# EAGLE design Week_9_8 (EAGLE 9.5.2)
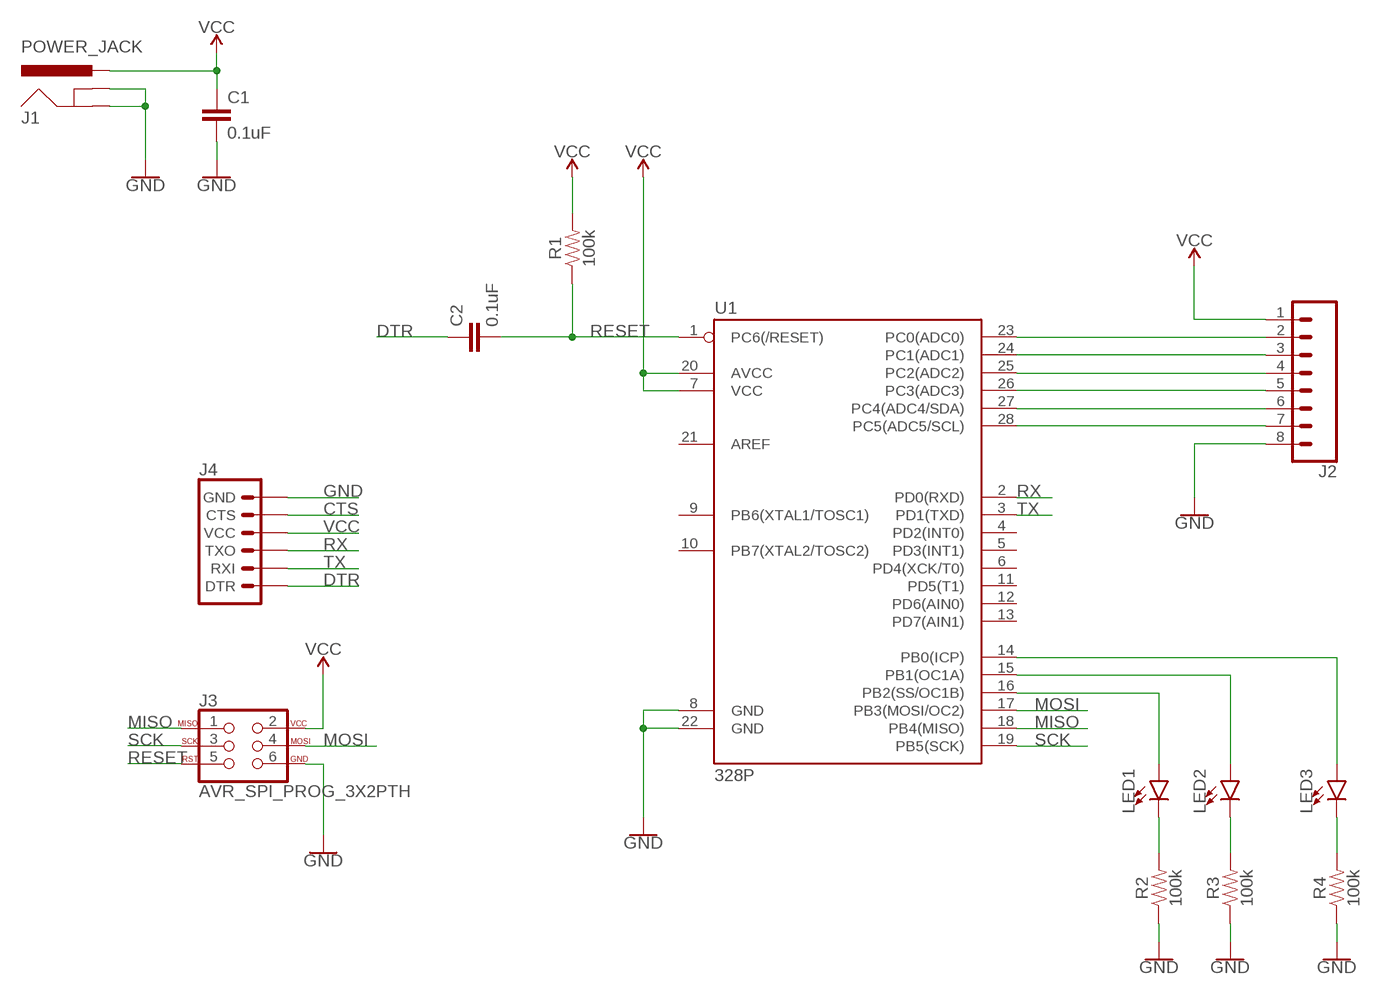
[diagram p0: schematic, sheet 1]

## Parts
C1  0.1uF  0.1UF-KIT-EZ-50V-20%  [CAP-PTH-SMALL-KIT]
C2  0.1uF  0.1UF-KIT-EZ-50V-20%  [CAP-PTH-SMALL-KIT]
J1  POWER_JACK  [POWER_JACK_PTH]
J2  CONN_08"  [1X08]
J3  AVR_SPI_PROG_3X2PTH  [2X3]
J4  6_PIN_SERIAL_TARGET  [1X06]
LED1  LED5MM  [LED_5MM]
LED2  LED5MM  [LED_5MM]
LED3  LED5MM  [LED_5MM]
R1  100k  100KOHM-HORIZ-1/4W-1%  [AXIAL-0.3]
R2  100k  100KOHM-HORIZ-1/4W-1%  [AXIAL-0.3]
R3  100k  100KOHM-HORIZ-1/4W-1%  [AXIAL-0.3]
R4  100k  100KOHM-HORIZ-1/4W-1%  [AXIAL-0.3]
U1  328P  ATMEGA328P_PDIP  [DIP28]

## Nets
CTS: J4.5(CTS)
DTR: C2.1 J4.1(DTR)
GND: C1.2 J1.GND J1.GNDBREAK J2.8 J3.6 J4.6(GND) R2.P$1 R3.P$1 R4.P$1 U1.8(GND) U1.22(GND)
MISO: J3.1 U1.18(PB4(MISO))
MOSI: J3.4 U1.17(PB3(MOSI/OC2))
N$2: LED3.K(C) R4.P$2
N$3: LED2.K(C) R3.P$2
N$4: LED1.K(C) R2.P$2
N$5: LED3.A U1.14(PB0(ICP))
N$6: LED2.A U1.15(PB1(OC1A))
N$7: LED1.A U1.16(PB2(SS/OC1B))
N$8: J2.2 U1.23(PC0(ADC0))
N$9: J2.3 U1.24(PC1(ADC1))
N$10: J2.4 U1.25(PC2(ADC2))
N$11: J2.5 U1.26(PC3(ADC3))
N$12: J2.6 U1.27(PC4(ADC4/SDA))
N$13: J2.7 U1.28(PC5(ADC5/SCL))
RESET: C2.2 J3.5 R1.P$1 U1.1(PC6(/RESET))
RX: J4.3(TXO) U1.2(PD0(RXD))
SCK: J3.3 U1.19(PB5(SCK))
TX: J4.2(RXI) U1.3(PD1(TXD))
VCC: C1.1 J1.PWR J2.1 J3.2 J4.4(VCC) R1.P$2 U1.7(VCC) U1.20(AVCC)
Unconnected: U1.4(PD2(INT0)) U1.5(PD3(INT1)) U1.6(PD4(XCK/T0)) U1.9(PB6(XTAL1/TOSC1)) U1.10(PB7(XTAL2/TOSC2)) U1.11(PD5(T1)) U1.12(PD6(AIN0)) U1.13(PD7(AIN1)) U1.21(AREF)

## Library data of the parts
C1 C2 = SparkFun-Capacitors:0.1UF: 0.1µF ceramic capacitors A capacitor is a passive two-terminal electrical component used to store electrical energy temporarily in an electric field.; PROD_ID: CAP-08370
J1 = SparkFun-Connectors:POWER_JACK: Power Jack Connector This is the standard 5.5mm barrel jack for power. The PTH is the most common, proven, reliable, footprint. The Slot footprint only works if the mill layer is transmitted to the PCB fab house so be warned. Here are the connectors we sell at SparkFun: DC Barrel Power Jack/Connector <https://www.sparkfun.com/products/119> (PRT-00119) DC Barrel Power Jack/Connector (SMD) <https://www.sparkfun.com/products/12748> (PRT-12748) DC Barrel Jack Adapter - Breadboard Compatible <https://www.sparkfun.com/products/10811> (PRT-10811) It is used on this SparkFun product (and many, many others): SparkFun RedBoard - Programmed with Arduino <https://www.sparkfun.com/products/12757> (DEV-12757) Also, if you need a mating power supply or connector, please check these out: Wall Adapter Power Supply - 9VDC 650mA <https://www.sparkfun.com/products/298> (TOL-00298) DC Barrel Jack Adapter - Male <https://www.sparkfun.com/products/10287> (PRT-10287); PROD_ID: CONN-08197
J2 = SparkFun-Connectors:CONN_08: Multi connection point. Often used as Generic Header-pin footprint for 0.1 inch spaced/style header connections On any of the 0.1 inch spaced packages, you can populate with these: Break Away Headers - Straight <https://www.sparkfun.com/products/116> (PRT-00116) Break Away Male Headers - Right Angle <https://www.sparkfun.com/products/553> (PRT-00553) Female Headers <https://www.sparkfun.com/products/115> (PRT-00115) Break Away Headers - Machine Pin <https://www.sparkfun.com/products/117> (PRT-00117) Break Away Female Headers - Swiss Machine Pin <https://www.sparkfun.com/products/743> (PRT-00743) Arduino Stackable Header - 8 Pin <https://www.sparkfun.com/products/9279> (PRT-09279) For SCREWTERMINALS and SPRING TERMINALS visit here: Screw Terimnals on SparkFun.com <https://www.sparkfun.com/search/results?term=Screw+Terminals> (5mm/3.5mm/2.54mm spacing) This device is also useful as a general connection point to wire up your design to another part of your project. Our various solder wires solder well into these plated through hole pads. Hook-Up Wire - Assortment (Stranded, 22 AWG) <https://www.sparkfun.com/products/11375> (PRT-11375) Hook-Up Wire - Assortment (Solid Core, 22 AWG) <https://www.sparkfun.com/products/11367> (PRT-11367) View the entire wire category on our website here <https://www.sparkfun.com/categories/141> Special notes: Molex polarized connector foot print use with SKU : PRT-08231 with associated crimp pins and housings. 1MM SMD Version SKU: PRT-10208 NOTES ON THE VARIANTS LOCK and LOCK_LONGPADS... This footprint was designed to help hold the alignment of a through-hole component (i.e. 6-pin header) while soldering it into place. You may notice that each hole has been shifted either up or down by 0.005 of an inch from it's more standard position (which is a perfectly straight line). This slight alteration caused the pins (the squares in the middle) to touch the edges of the holes. Because they are alternating, it causes a "brace" to hold the component in place. 0.005 has proven to be the perfect amount of "off-center" position when using our standard breakaway headers. Although looks a little odd when you look at the bare footprint, once you have a header in there, the alteration is very hard to notice. Also,if you push a header all the way into place, it is covered up entirely on the bottom side.; PROD_ID: CONN-08438
J3 = SparkFun-Connectors:AVR_SPI_PROG_3X2: AVR ISP 6 Pin This is the reduced ISP connector for AVR programming. Common on Arduino. This footprint will take up less PCB space and can be used with a 10-pin to 6-pin adapter such as SKU: BOB-08508 **Special note about "TEST_POINT" package. The stop mask is on the top side, so if you want your programming test points to be on the bottom of your board, make sure to place this package on the bottom side of the board. This also ensure that the orientation to program from the bottom side will be correct. SparkFun Products: SparkFun ISP Pogo Adapter <https://www.sparkfun.com/products/11591> - NS Tiny AVR Programmer <https://www.sparkfun.com/products/11801> -PTH
J4 = SparkFun-Connectors:6_PIN_SERIAL_TARGET: 6-pin header connection for use with the "FTDI BASIC" pinout - TARGET SIDE. Also known as "Arduino Serial Program Header". It is used to mate with our FTDI Basic serial programmers using the Arduino IDE. Note, this device has "TARGET" in the name. It is intended to be used on a design that contains a target micro-controller that you wish to program. The "sister" device, named "CABLE" is inteneded to be used on a design that usually lives on the end of your USB cable and prvides the converter chip (FTDI232 or FTDI231x) to commnicate serial RX/TX. You can populate with some of these: Break Away Headers - Straight <https://www.sparkfun.com/products/116> (PRT-00116) For reference (or to suit your programming needs) check out these designs: SparkFun FTDI Basic Breakout - 5V <https://www.sparkfun.com/products/9716> (DEV-09716) SparkFun FTDI Basic Breakout - 3.3V <https://www.sparkfun.com/products/9873> (DEV-09873) SparkFun FTDI SmartBasic <https://www.sparkfun.com/products/12935> (DEV-12935) SparkFun Beefy 3 - FTDI Basic Breakout <https://www.sparkfun.com/products/13746> (DEV-13746)
LED1-LED3 = SparkFun-LED:LED: LED (Generic) Standard schematic elements and footprints for 5mm, 3mm, 1206, and 0603 sized LEDs. Generic LEDs with no color specified.
R1-R4 = SparkFun-Resistors:100KOHM: 100kΩ resistor A resistor is a passive two-terminal electrical component that implements electrical resistance as a circuit element. Resistors act to reduce current flow, and, at the same time, act to lower voltage levels within circuits. - Wikipedia; PROD_ID: RES-12184
U1 = SparkFun-IC-Microcontroller:ATMEGA328P_PDIP: Atmel 328P Through hole ATMEGA328P uC used in the Arduino 32kb flash, 1k EEPROM, 2k SRAM Datasheet <http://www.sparkfun.com/datasheets/Components/SMD/ATMega328.pdf> SparkFun Products Storefront component: AVR 28 Pin 20MHz 32K 6A/D - ATMega328P <https://www.sparkfun.com/products/9061> (COM-09061) SparkFun Simon Says - Through-Hole Soldering Kit <https://www.sparkfun.com/products/10547> (KIT-10547) SparkFun Learn to Solder - Simon Says <https://www.sparkfun.com/products/13708> (KIT-13708) SparkFun BigTime Watch Kit <https://www.sparkfun.com/products/11734> (KIT-11734) SparkFun ClockIt <https://www.sparkfun.com/products/10930> (KIT-10930) SparkFun Serial Enabled LCD Kit <https://www.sparkfun.com/products/10097> (LCD-10097) SparkFun Simon Tilts - Through Hole Soldering Kit <https://www.sparkfun.com/products/12634> (KIT-12634) SparkFun Frequency Counter Kit <https://www.sparkfun.com/products/10140> (KIT-10140) FabFM Radio Kit <https://www.sparkfun.com/products/11043> (KIT-11043) SparkFun Binary Blaster Kit <https://www.sparkfun.com/products/12037> (KIT-12037) SparkFun Metro-Gnome <https://www.sparkfun.com/products/9236> (KIT-09236) ATmega328 with Arduino Optiboot (Uno) <https://www.sparkfun.com/products/10524> (DEV-10524); PROD_ID: IC-09136

## Board
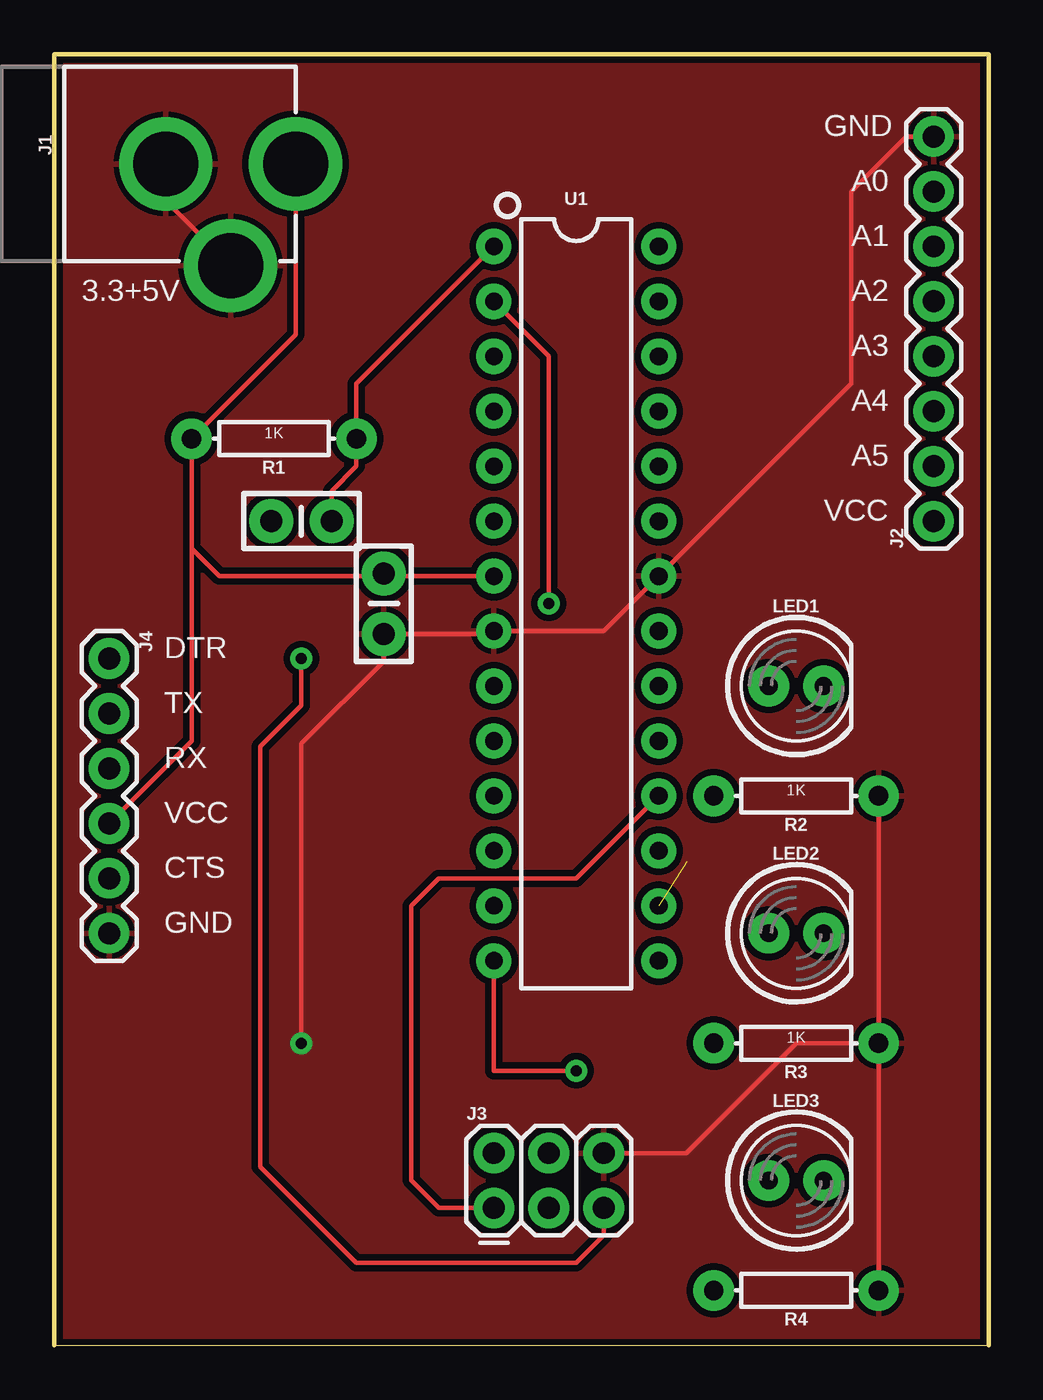
[diagram p1: board, top side]
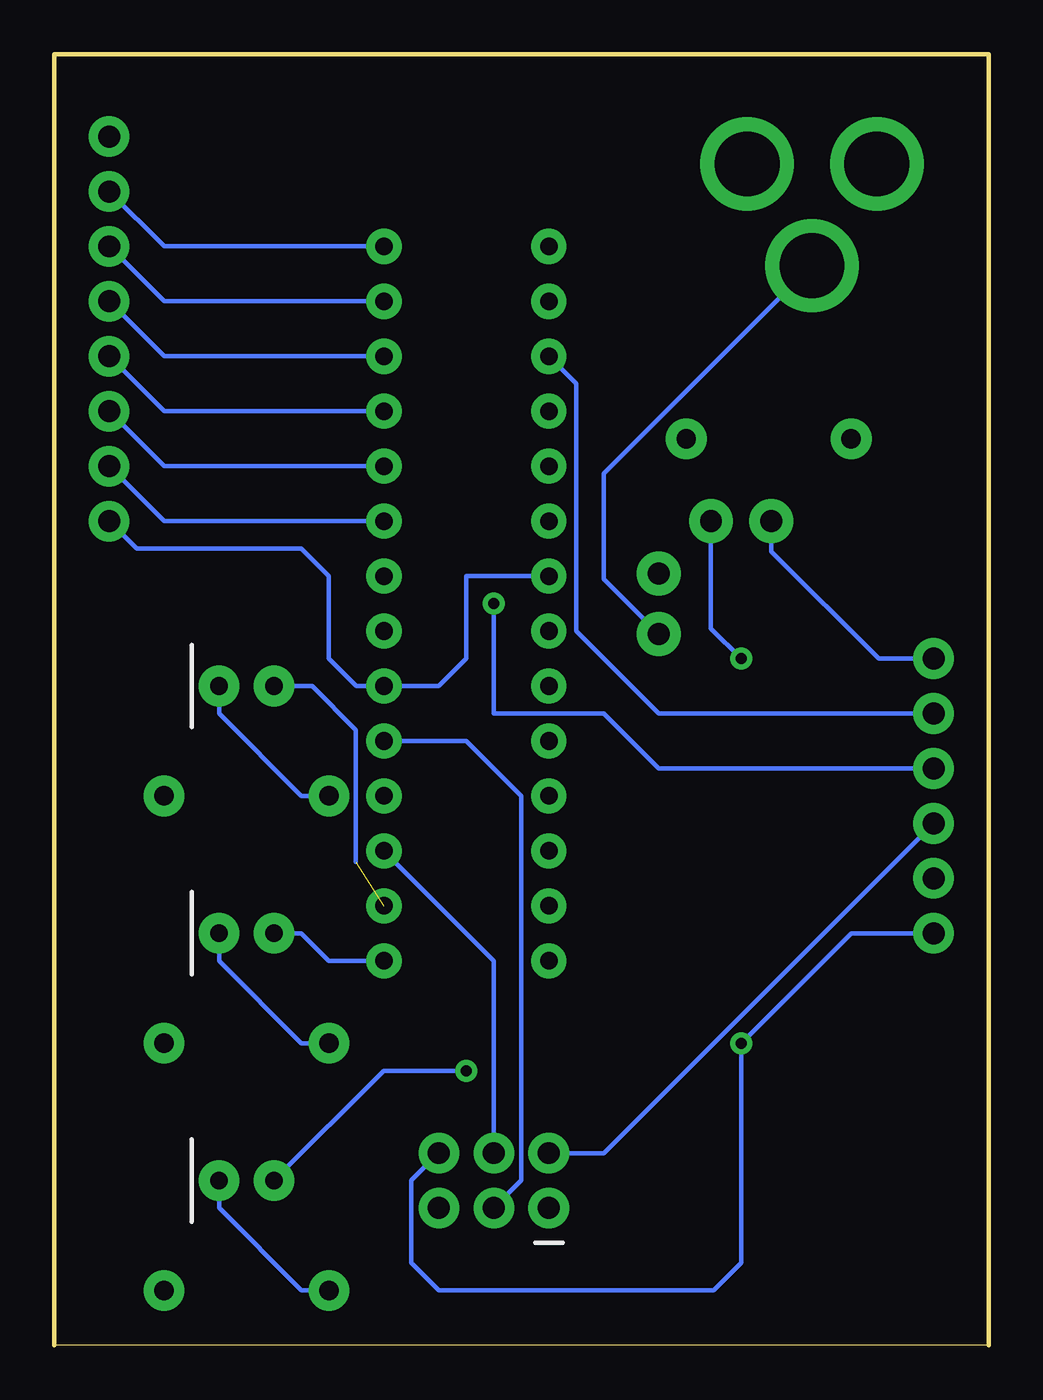
[diagram p2: board, bottom side, seen from below]

Size 43.18 x 59.69 mm. Coordinates in mm from the lower left corner, seen from the top.
Outline: 0,0 43.18,0 43.18,59.69 0,59.69 0,0
Copper layers (1*16): Top 0.035mm / dielectric 1.5mm / Bottom 0.035mm
Design rules "SparkFun": minimum track width 8mil, minimum drill 20mil, track to track 8mil, track to pad 8mil, pad to pad 8mil, via to via 8mil, smd to smd 8mil, copper to edge 8mil, drill to drill 8mil, minimum pad ring 12mil, minimum via ring 10mil, stop-mask expansion 4mil, vias tented up to drill 20mil, thermal gap 10mil

### Footprints (pad centres in the part's own frame; a part is rotated, then mirrored left to right if it is on the bottom)
CAP-PTH-SMALL-KIT = drill 1.016 pad 2.032: 1 -1.397,0; 2 1.397,0
POWER_JACK_PTH = drill 2.997 pad 4.318: GND 0,7.7; GNDBREAK 4.7,10.7; PWR 0,13.7
1X08 = drill 1.016 pad 1.88: 1 0,0; 2 2.54,0; 3 5.08,0; 4 7.62,0; 5 10.16,0; 6 12.7,0; 7 15.24,0; 8 17.78,0
2X3 = drill 1.016 pad 1.88: 1 0,0; 2 0,2.54; 3 2.54,0; 4 2.54,2.54; 5 5.08,0; 6 5.08,2.54
1X06 = drill 1.016 pad 1.88: 1 0,0; 2 2.54,0; 3 5.08,0; 4 7.62,0; 5 10.16,0; 6 12.7,0
LED_5MM = drill 0.813 pad 1.88: A -1.27,0; K 1.27,0
AXIAL-0.3 = drill 0.9 pad 1.88: P$1 -3.81,0; P$2 3.81,0
DIP28 = drill 0.813 pad 1.626: 1 -16.51,-3.81; 2 -13.97,-3.81; 3 -11.43,-3.81; 4 -8.89,-3.81; 5 -6.35,-3.81; 6 -3.81,-3.81; 7 -1.27,-3.81; 8 1.27,-3.81; 9 3.81,-3.81; 10 6.35,-3.81; 11 8.89,-3.81; 12 11.43,-3.81; 13 13.97,-3.81; 14 16.51,-3.81; 15 16.51,3.81; 16 13.97,3.81; 17 11.43,3.81; 18 8.89,3.81; 19 6.35,3.81; 20 3.81,3.81; 21 1.27,3.81; 22 -1.27,3.81; 23 -3.81,3.81; 24 -6.35,3.81; 25 -8.89,3.81; 26 -11.43,3.81; 27 -13.97,3.81; 28 -16.51,3.81

### Placement (x,y rotation side)
C1  15.24,34.29 270 top
C2  11.43,38.1 0 top
J1  -2.54,54.61 270 top
J2  40.64,38.1 90 top
J3  20.32,6.35 0 top
J4  2.54,31.75 270 top
LED1  34.29,30.48 0 top
LED2  34.29,19.05 0 top
LED3  34.29,7.62 0 top
R1  10.16,41.91 180 top
R2  34.29,25.4 180 top
R3  34.29,13.97 180 top
R4  34.29,2.54 180 top
U1  24.13,34.29 270 top

### Tracks (layer width: path | path; a pad name or v marks a point on that pad's centre or on a via)
DTR
  Bottom 0.203: J4.1 5.08,31.75 10.03,36.7 C2.1
GND  (via drill 0.51)
  Top 0.203: J2.8 39.37,55.88 36.83,53.34 36.83,44.45 U1.22 25.4,33.02 U1.8 20.19,32.89 C1.2 15.24,31.62 11.43,27.81 v11.43,13.97 | J1.GND 5.16,52.91 J1.GNDBREAK | R2.P$1 R3.P$1 | R3.P$1 R4.P$1 | J3.6 29.21,8.89 34.29,13.97 R3.P$1
  Bottom 0.203: J4.6 6.35,19.05 v11.43,13.97 11.43,3.81 12.7,2.54 25.4,2.54 26.67,3.81 26.67,7.62 J3.6 | J1.GNDBREAK 17.78,40.29 17.78,35.43 C1.2
  pour Top (isolate 0.305): 0,0 0,59.69 43.18,59.69 43.18,0
MISO
  Top 0.203: J3.1 17.78,6.35 16.51,7.62 16.51,20.32 17.78,21.59 24.13,21.59 U1.18
MOSI
  Bottom 0.203: U1.17 22.86,17.78 J3.4
N$2
  Bottom 0.203: R4.P$2 31.75,2.54 35.56,6.35 LED3.K
N$3
  Bottom 0.203: R3.P$2 31.75,13.97 35.56,17.78 LED2.K
N$4
  Bottom 0.203: R2.P$2 31.75,25.4 35.56,29.21 LED1.K
N$5  (via drill 0.51)
  Top 0.203: U1.14 20.32,12.7 v24.13,12.7
  Bottom 0.203: LED3.A 27.94,12.7 v24.13,12.7
N$6
  Bottom 0.203: LED2.A 31.75,19.05 30.48,17.78 U1.15
N$7  (1 unrouted)
  Bottom 0.203: 29.23,22.34 29.23,28.46 31.26,30.48 LED1.A
N$8
  Bottom 0.203: U1.23 38.1,38.1 J2.2
N$9
  Bottom 0.203: U1.24 38.1,40.64 J2.3
N$10
  Bottom 0.203: U1.25 38.1,43.18 J2.4
N$11
  Bottom 0.203: U1.26 38.1,45.72 J2.5
N$12
  Bottom 0.203: U1.27 38.1,48.26 J2.6
N$13
  Bottom 0.203: J2.7 38.1,50.8 U1.28
RESET  (via drill 0.51)
  Top 0.203: U1.1 13.97,44.45 R1.P$1 13.97,40.64 12.83,39.5 C2.2 | J3.5 25.4,5.08 24.13,3.81 13.97,3.81 9.53,8.25 9.53,27.68 11.43,29.59 v11.43,31.75
  Bottom 0.203: C2.2 12.83,33.15 v11.43,31.75
RX  (via drill 0.51)
  Top 0.203: U1.2 22.86,45.72 v22.86,34.29
  Bottom 0.203: J4.3 15.24,26.67 17.78,29.21 22.86,29.21 v22.86,34.29
SCK
  Bottom 0.203: U1.19 24.13,27.94 21.59,25.4 21.59,7.62 J3.3
TX
  Bottom 0.203: J4.2 15.24,29.21 19.05,33.02 19.05,44.45 U1.3
VCC
  Top 0.203: J1.PWR 11.16,46.72 R1.P$2 6.35,36.83 | 6.35,36.83 7.62,35.56 15.11,35.56 C1.1 15.37,35.56 U1.7 | J4.4 6.35,27.94 6.35,36.83
  Bottom 0.203: J2.1 39.37,36.83 31.75,36.83 30.48,35.56 30.48,31.75 29.21,30.48 U1.20 25.4,30.48 24.13,31.75 24.13,35.56 U1.7 | J4.4 17.78,8.89 J3.2

### Text on the board
tPlace: GND | A0 | A1 | 3.3+5V | A2 | A3 | A4 | 1K | A5 | VCC | DTR | TX | RX | 1K | VCC | CTS | GND | 1K